# EAGLE schematic EasyDriver_modified (EAGLE 9.3.1)
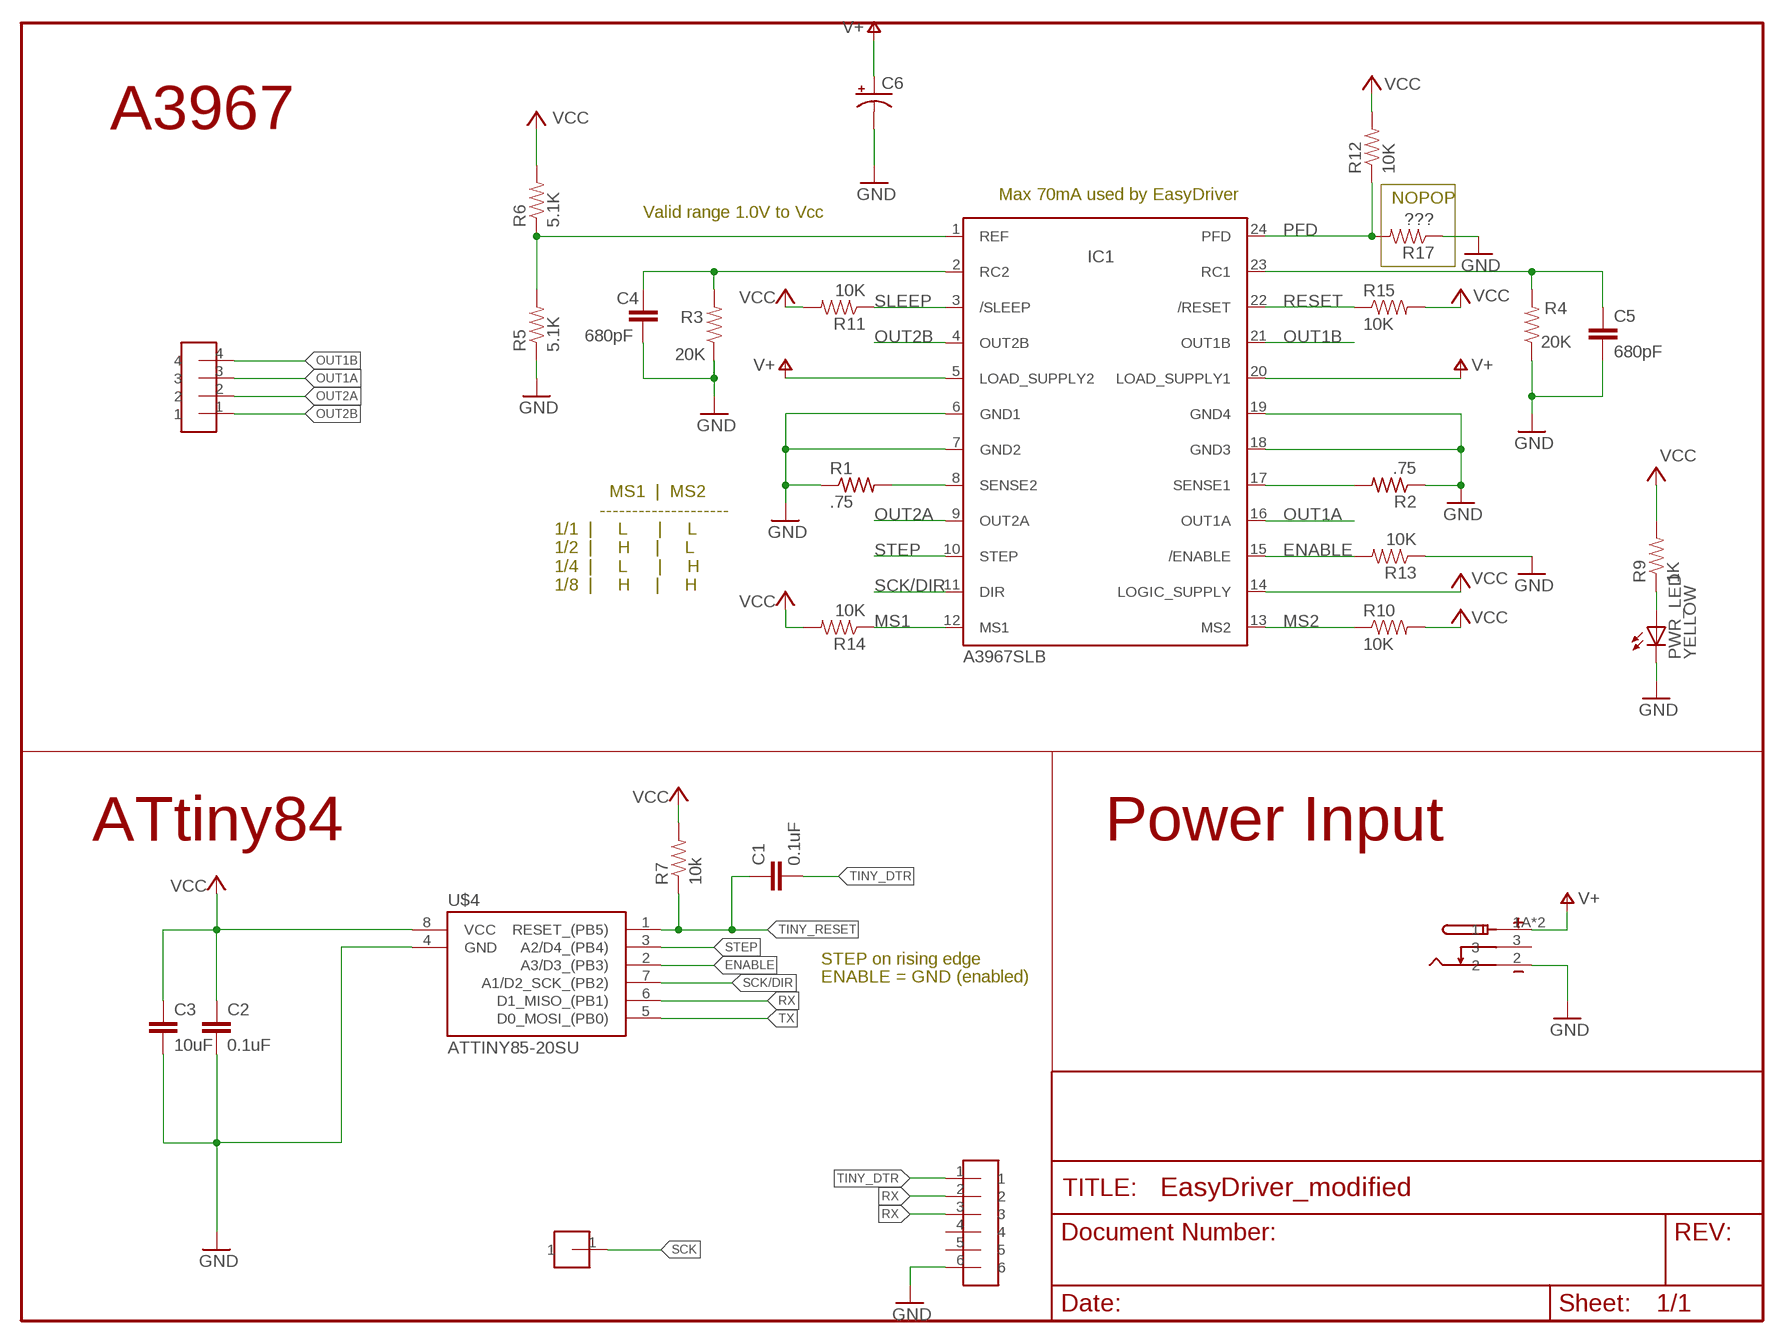
[diagram p0: schematic, sheet 1]

## Parts
C1  0.1uF  CAP0603-CAP  [0603-CAP]
C2  0.1uF  CAP0603-CAP  [0603-CAP]
C3  10uF  CAP0603-CAP  [0603-CAP]
C4  680pF  CAP0402  [C0402]
C5  680pF  CAP0402  [C0402]
C6  CAP_POLG  [PANASONIC_G]
IC1  A3967SLB  [SO24W]
PWR_LED  YELLOW  LED0603  [LED-0603]
R1  .75  R-US_R0805  [R0805]
R2  .75  R-US_R0805  [R0805]
R3  20K  RESISTOR0402  [C0402]
R4  20K  RESISTOR0402  [C0402]
R5  5.1K  RESISTOR0402  [C0402]
R6  5.1K  RESISTOR0402  [C0402]
R7  10k  RESISTOR0603  [0603-RES]
R9  1K  RESISTOR0402  [C0402]
R10  10K  RESISTOR0402  [C0402]
R11  10K  RESISTOR0402  [C0402]
R12  10K  RESISTOR0402  [C0402]
R13  10K  RESISTOR0402  [C0402]
R14  10K  RESISTOR0402  [C0402]
R15  10K  RESISTOR0402  [C0402]
R17  ???  RESISTOR0402  [C0402]
U$1  HEADER-6  [HEADER-6]
U$2  DC-BARREL-CONN-SMD  [694106106102]
U$3  HEADER-1-TESTPOINT  [TESTPOINT-1]
U$4  ATTINY85-20SU  [SOIC8]
U$5  HEADER-4  [HEADER-4]

## Nets
+5V: C2.1 C3.1 R7.2 U$4.8(VCC) ; supply symbol labelled VCC
ENABLE: IC1.15(/ENABLE) R13.2 U$4.2(A3/D3_(PB3))
GND: C2.2 C3.2 C4.2 C5.2 C6.- IC1.6(GND1) IC1.7(GND2) IC1.18(GND3) IC1.19(GND4) PWR_LED.C R1.1 R2.1 R3.1 R4.1 R5.1 R13.1 R17.1 U$1.6 U$2.2 U$4.4(GND)
MS1: IC1.12(MS1) R14.1
MS2: IC1.13(MS2) R10.1
N$1: IC1.8(SENSE2) R1.2
N$2: PWR_LED.A R9.1
N$3: IC1.17(SENSE1) R2.2
N$5: C4.1 IC1.2(RC2) R3.2
N$7: C5.1 IC1.23(RC1) R4.2
N$12: IC1.1(REF) R5.2 R6.1
OUT1A: IC1.16(OUT1A) U$5.3
OUT1B: IC1.21(OUT1B) U$5.4
OUT2A: IC1.9(OUT2A) U$5.2
OUT2B: IC1.4(OUT2B) U$5.1
PFD: IC1.24(PFD) R12.1 R17.2
RESET: IC1.22(/RESET) R15.1
RX: U$1.2 U$1.3 U$4.6(D1_MISO_(PB1))
SCK: U$3.1
SCK/DIR: IC1.11(DIR) U$4.7(A1/D2_SCK_(PB2))
SLEEP: IC1.3(/SLEEP) R11.1
STEP: IC1.10(STEP) U$4.3(A2/D4_(PB4))
TINY_DTR: C1.2 U$1.1
TINY_RESET: C1.1 R7.1 U$4.1(RESET_(PB5))
TX: U$4.5(D0_MOSI_(PB0))
V+: C6.+ IC1.5(LOAD_SUPPLY2) IC1.20(LOAD_SUPPLY1) U$2.1A U$2.1B
VCC: IC1.14(LOGIC_SUPPLY) R6.2 R9.2 R10.2 R11.2 R12.2 R14.2 R15.2
Unconnected: U$1.4 U$1.5 U$2.3

## Notes on the sheet
- A3967
- Max 70mA used by EasyDriver | NOPOP
- Valid range 1.0V to Vcc
- MS1  |  MS2
           --------------------
  1/1  |     L      |     L 
  1/2  |     H     |     L 
  1/4  |     L      |     H 
  1/8  |     H     |     H
- ATtiny84 | Power Input
- STEP on rising edge
- ENABLE = GND (enabled)

## Library data of the parts
C1-C3 = homemade-hardware:CAP: Capacitor Standard 0603 ceramic capacitor, and 0.1" leaded capacitor.
C4 C5 = SparkFun03_30_09:CAP: Capacitor Standard 0603 ceramic capacitor, and 0.1" leaded capacitor.
C6 = homemade-hardware:CAP_POL: Capacitor Polarized These are standard SMD and PTH capacitors. Normally 10uF, 47uF, and 100uF in electrolytic and tantalum varieties. Always verify the external diameter of the through hole cap, it varies with capacity, voltage, and manufacturer. The EIA devices should be standard.
IC1 = Allegro:A3967SLB: ANALOG DEVICES
PWR_LED = SparkFun03_30_09:LED: LEDs Standard schematic elements and footprints for 5mm, 3mm, 1206, and 0603 sized LEDs. 5mm - Spark Fun Electronics SKU : COM-00529 (and others)
R1 R2 = rcl:R-US_: RESISTOR, American symbol
R3-R6 R9-R15 R17 = SparkFun03_30_09:RESISTOR: Resistor
R7 = homemade-hardware:RESISTOR: Resistor
U$1 = homemade-hardware:HEADER-6
U$2 = homemade-hardware:DC-BARREL-CONN: 694106106102 <https://www.digikey.com/products/en/connectors-interconnects/barrel-power-connectors/435?k=694106106102&k=&pkeyword=694106106102&sv=0&pv7=2&sf=0&quantity=&ColumnSort=0&page=1&pageSize=25>: SMD DC Barrel (OD=5.5mm, ID=2mm)
U$3 = homemade-hardware:HEADER-1
U$4 = homemade-hardware:ATTINY85
U$5 = homemade-hardware:HEADER-4